# Altium project MPPT_600W.PrjPcb (part 2 of 2)

## Sheet MPPT_POWER.SchDoc
size A3; SheetNumber: 3; SheetTotal: 3
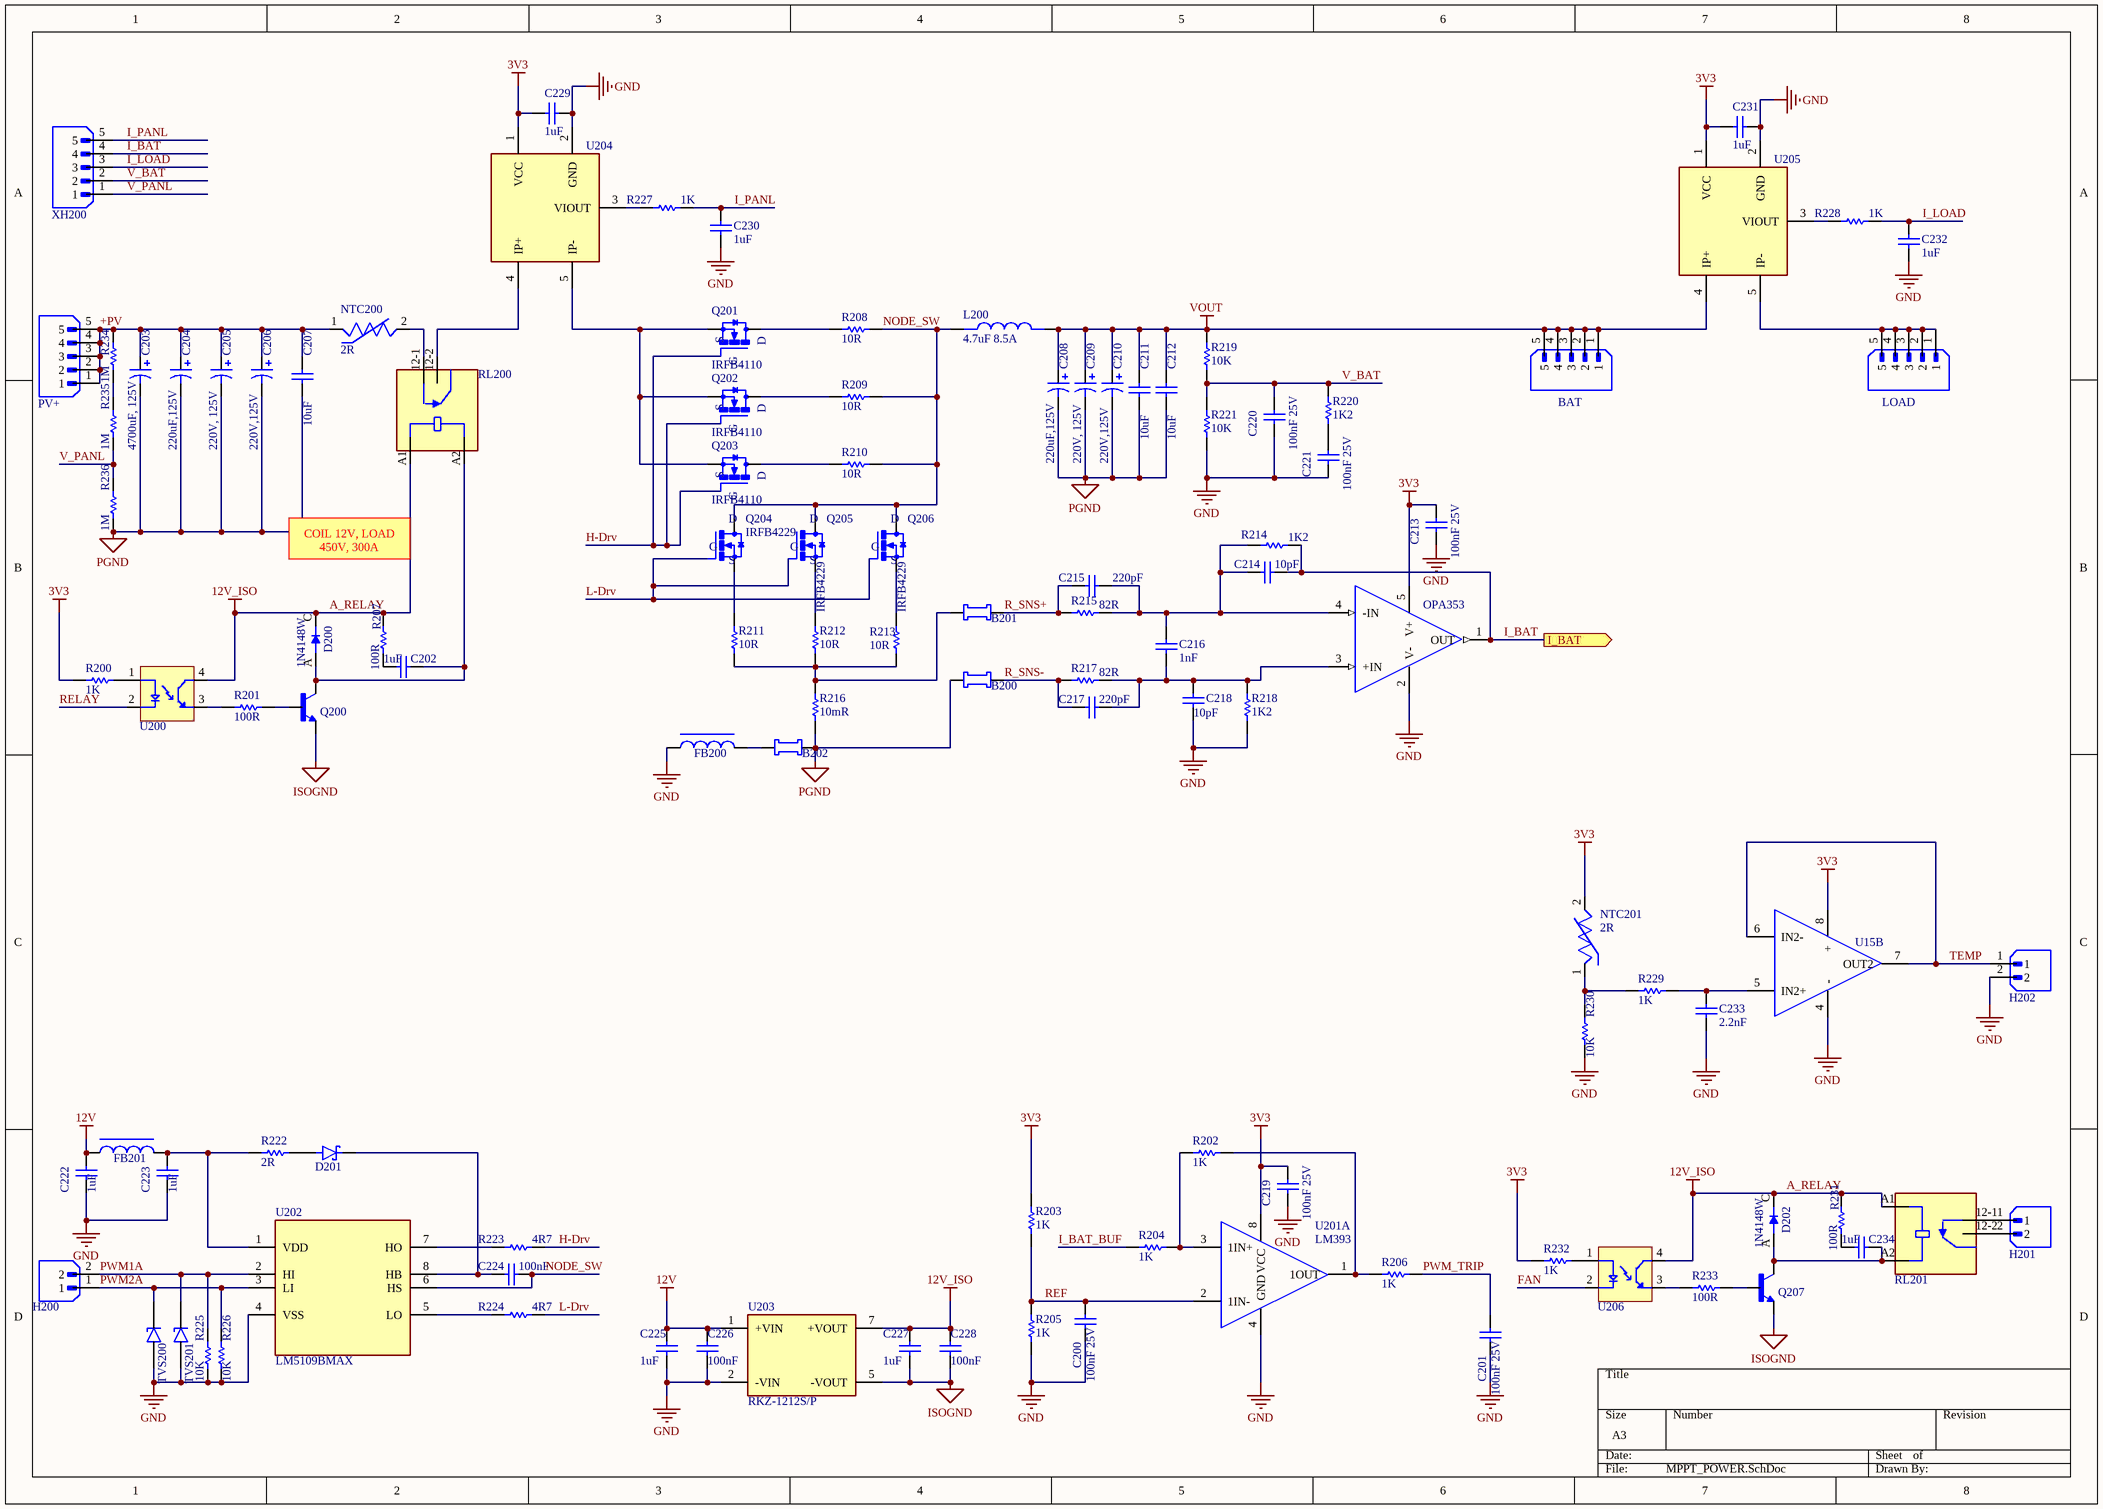
[diagram p1: MPPT_POWER.SchDoc]

### Parts
*  OPA353
B200  Narrow Neck Bridge  [Narrow Bridge]  (value not drawn)
B201  Narrow Neck Bridge  [Narrow Bridge]  (value not drawn)
B202  Narrow Neck Bridge  [Narrow Bridge]  (value not drawn)
BAT  B5B-XH-A(LF)(SN)  [XH2.54 5p]  (value not drawn)
C200  100nF 25V  [Cap cer 0603]
C201  100nF 25V  [Cap cer 0603]
C202  1uF  [Cap cer 0603]
C203  value 4700uF, 125V  [C0805]  (hidden comment: Cap Pol3)
C204  value 220uF,125V  [C0805]  (hidden comment: Cap Pol3)
C205  value 220V, 125V  [C0805]  (hidden comment: Cap Pol3)
C206  value 220V,125V  [C0805]  (hidden comment: Cap Pol3)
C207  10uF  [Cap cer 0603]
C208  value 220uF,125V  [C0805]  (hidden comment: Cap Pol3)
C209  value 220V, 125V  [C0805]  (hidden comment: Cap Pol3)
C210  value 220V,125V  [C0805]  (hidden comment: Cap Pol3)
C211  10uF  [Cap cer 0603]
C212  10uF  [Cap cer 0603]
C213  100nF 25V  [Cap cer 0603]
C214  10pF  [Cap cer 0603]
C215  220pF  [Cap cer 0603]
C216  1nF  [Cap cer 0603]
C217  220pF  [Cap cer 0603]
C218  10pF  [Cap cer 0603]
C219  100nF 25V  [Cap cer 0603]
C220  100nF 25V  [Cap cer 0603]
C221  100nF 25V  [Cap cer 0603]
C222  1uF  [Cap cer 0603]
C223  1uF  [Cap cer 0603]
C224  100nF  [Cap cer 0603]
C225  1uF  [Cap cer 0603]
C226  100nF  [Cap cer 0603]
C227  1uF  [Cap cer 0603]
C228  100nF  [Cap cer 0603]
C229  1uF  [Cap cer 0603]
C230  1uF  [Cap cer 0603]
C231  1uF  [Cap cer 0603]
C232  1uF  [Cap cer 0603]
C233  2.2nF  [Cap cer 0603]
C234  1uF  [Cap cer 0603]
D200  1N4148W  [1N4148]
D201  B340A-13-F  [B340A]  (value not drawn)
D202  1N4148W  [1N4148]
FB200  Ferrite Beads Multi-Layer 390Ohm 25% 100MHz 500mA 300mOhm DCR 0603 Automotive T/R  [FERRITE BEAD 0603]  (value not drawn)
FB201  Ferrite Beads Multi-Layer 390Ohm 25% 100MHz 500mA 300mOhm DCR 0603 Automotive T/R  [FERRITE BEAD 0603]  (value not drawn)
H200  HEADER 2P 2.54  [HEADER 2P 2.544]  (value not drawn)
H201  HEADER 2P 2.54  [HEADER 2P 2.544]  (value not drawn)
H202  HEADER 2P 2.54  [HEADER 2P 2.544]  (value not drawn)
L200  4.7uF 8.5A  [Inductor 4.7uF 8.5A]
LOAD  B5B-XH-A(LF)(SN)  [XH2.54 5p]  (value not drawn)
NTC200  2R
NTC201  2R
PV+  B5B-XH-A(LF)(SN)  [XH2.54 5p]  (value not drawn)
Q200  MMBT3904  [MMBT3904]  (value not drawn)
Q201  IRFB4110
Q202  IRFB4110
Q203  IRFB4110
Q204  IRFB4229
Q205  IRFB4229
Q206  IRFB4229
Q207  MMBT3904  [MMBT3904]  (value not drawn)
R200  1K  [Res 0603]
R201  100R  [Res 0603]
R202  1K  [Res 0603]
R203  1K  [Res 0603]
R204  1K  [Res 0603]
R205  1K  [Res 0603]
R206  1K  [Res 0603]
R207  100R  [Res 0603]
R208  10R  [Res 0603]
R209  10R  [Res 0603]
R210  10R  [Res 0603]
R211  10R  [Res 0603]
R212  10R  [Res 0603]
R213  10R  [Res 0603]
R214  1K2  [Res 0603]
R215  82R  [Res 0603]
R216  10mR  [Res 0603]
R217  82R  [Res 0603]
R218  1K2  [Res 0603]
R219  10K  [Res 0603]
R220  1K2  [Res 0603]
R221  10K  [Res 0603]
R222  2R  [Res 0603]
R223  4R7  [Res 0603]
R224  4R7  [Res 0603]
R225  10K  [Res 0603]
R226  10K  [Res 0603]
R227  1K  [Res 0603]
R228  1K  [Res 0603]
R229  1K  [Res 0603]
R230  10K  [Res 0603]
R231  100R  [Res 0603]
R232  1K  [Res 0603]
R233  100R  [Res 0603]
R234  1M  [Res 0603]
R235  1M  [Res 0603]
R236  1M  [Res 0603]
RL200  (no value)
RL201  (no value)
TVS200  SMCJ5.0A-13-F  [TVS 5V]  (value not drawn)
TVS201  SMCJ5.0A-13-F  [TVS 5V]  (value not drawn)
U15  LM358DT  [LM358]  (value not drawn)  (part B of 2)
U200  PC817X1NIP1B  [PC817]  (value not drawn)
U201  LM393  [lm393]  (part A of 2)
U202  LM5109BMAX  [LM5109B]
U203  RKZ-1212S/P  [1212S]
U204  ACS758LCB-100U-PFF-T  [ACS758]  (value not drawn)
U205  ACS758LCB-100U-PFF-T  [ACS758]  (value not drawn)
U206  PC817X1NIP1B  [PC817]  (value not drawn)
XH200  B5B-XH-A(LF)(SN)  [XH2.54 5p]  (value not drawn)

### Ports
I_BAT (out)

### Nets
3V3: *.5(V+) C213.2 C219.2 C229.2 C231.2 NTC201.2 R200.1 R203.2 R232.1 U15.8(+) U201.8(VCC) U204.1(VCC) U205.1(VCC)
12V: C222.2 C225.1 C226.1 FB201.1 U203.1(+VIN)
A_RELAY: C227.1 C228.1 D200.C(K) D202.C(K) R207.2 R231.2 RL200.A1(COIL1) RL201.A1(COIL1) U200.4(CT) U203.7(+VOUT) U206.4(CT)  [also labelled 12V_ISO]
GND: *.2(V-) C200.1 C201.1 C213.1 C218.2 C219.1 C220.1 C221.1 C222.1 C223.1 C225.2 C226.2 C229.1 C230.1 C231.1 C232.1 C233.2 FB200.1 H202.2 R205.1 R218.1 R221.1 R225.1 R226.1 R230.1 TVS200.2(A) TVS201.2(A) U15.4(-) U201.4(GND) U202.4(VSS) U203.2(-VIN) U204.2(GND) U205.2(GND)
ISOGND: C227.2 C228.2 Q200.2(E) Q207.2(E) U203.5(-VOUT)
PGND: B200.1 B202.2 C203.2 C204.2 C205.2 C206.2 C207.2 C208.2 C209.2 C210.2 C211.2 C212.2 R216.2 R236.1
VOUT: BAT.1 BAT.2 BAT.3 BAT.4 BAT.5 C208.1 C209.1 C210.1 C211.1 C212.1 L200.2 R219.2 U205.4(IP+)
+PV: C203.1 C204.1 C205.1 C206.1 C207.1 NTC200.1 PV+.1 PV+.2 PV+.3 PV+.4 PV+.5 R234.2
FAN: U206.2(C)
H-Drv: Q201.1(G) Q202.1(G) Q203.1(G) R223.1
I_BAT: *.1(OUT) C214.2 R214.1 XH200.4 ; port I_BAT
I_BAT_BUF: R204.1
I_LOAD: C232.2 R228.1 XH200.3
I_PANL: C230.2 R227.1 XH200.5
L-Drv: Q204.1(G) Q205.1(G) Q206.1(G) R224.1
NODE_SW: C224.1 L200.1 Q204.2(D) Q205.2(D) Q206.2(D) R208.2 R209.2 R210.2 U202.6(HS)
PWM1A: H200.2 R225.2 TVS201.1(C) U202.2(HI)
PWM2A: H200.1 R226.2 TVS200.1(C) U202.3(LI)
PWM_TRIP: C201.2 R206.2
R_SNS+: B201.2 C215.2 R215.1
R_SNS-: B200.2 C217.2 R217.1
REF: C200.2 R203.1 R205.2 U201.2(1IN-)
RELAY: U200.2(C)
TEMP: H202.1 U15.6(IN2-) U15.7(OUT2)
V_BAT: C220.2 R219.1 R220.1 R221.2 XH200.2
V_PANL: R235.1 R236.2 XH200.1
Net*_3: *.3(+IN) C216.2 C217.1 C218.1 R217.2 R218.2
Net*_4: *.4(-IN) C214.1 C215.1 C216.1 R214.2 R215.2
NetB201_1: B201.1 R211.1 R212.1 R213.1 R216.1
NetB202_1: B202.1 FB200.2
NetC202_1: C202.1 D200.A Q200.3(C) RL200.A2(COIL2)
NetC202_2: C202.2 R207.1
NetC221_2: C221.2 R220.2
NetC223_2: C223.2 FB201.2 R222.2 U202.1(VDD)
NetC224_2: C224.2 D201.C U202.8(HB)
NetC233_1: C233.1 R229.1 U15.5(IN2+)
NetC234_1: C234.1 D202.A Q207.3(C) RL201.A2(COIL2)
NetC234_2: C234.2 R231.1
NetD201_A: D201.A R222.1
NetH201_1: H201.1 RL201.12-1(NC)
NetH201_2: H201.2 RL201.12-2(NC)
NetLOAD_1: LOAD.1 LOAD.2 LOAD.3 LOAD.4 LOAD.5 U205.5(IP-)
NetNTC200_2: NTC200.2 RL200.12-1(NC)
NetNTC201_1: NTC201.1 R229.2 R230.2
NetQ200_1: Q200.1(B) R201.2
NetQ201_2: Q201.2(D) R208.1
NetQ201_3: Q201.3(S) Q202.3(S) Q203.3(S) U204.5(IP-)
NetQ202_2: Q202.2(D) R209.1
NetQ203_2: Q203.2(D) R210.1
NetQ204_3: Q204.3(S) R211.2
NetQ205_3: Q205.3(S) R212.2
NetQ206_3: Q206.3(S) R213.2
NetQ207_1: Q207.1(B) R233.2
NetR200_2: R200.2 U200.1(A)
NetR201_1: R201.1 U200.3(ET)
NetR202_1: R202.1 R204.2 U201.3(1IN+)
NetR202_2: R202.2 R206.1 U201.1(1OUT)
NetR223_2: R223.2 U202.7(HO)
NetR224_2: R224.2 U202.5(LO)
NetR227_2: R227.2 U204.3(VIOUT)
NetR228_2: R228.2 U205.3(VIOUT)
NetR232_2: R232.2 U206.1(A)
NetR233_1: R233.1 U206.3(ET)
NetR234_1: R234.1 R235.2
NetRL200_12-2: RL200.12-2(NC) U204.4(IP+)

### Notes on the sheet
- COIL 12V, LOAD 450V, 300A

### Library data of the parts
BAT LOAD PV+ XH200 = B5B-XH-A(LF)(SN): Connector Header, XH Series, 5 Position, 2.50mm, Through Hole, Press-Fit, Solder, Natural; Manufacturer: JST; Voltage Rating: 250V; Number of Positions: 5; Gender: 29Gender; Contact Post Length: 0.134inch; Mated Stacking Heights: 9.8mm; Supplier 1: Future Electronics; Manufacturer Part Number: B5B-XH-A(LF)(SN); RoHS: Yes; Category: Headers and Wire Housings; Stock 1: 3816; Pricing 1: 1=0,106, 250=0,103, 1000=0,0996, 2500=0,0972, 10000=0,0916 (USD); Mount: Through Hole; Contact Material: Brass; Contact Shape: Square; Contact Finish - Mating: TIN; Insulation Material: Nylon; Insulation Color: Natural; Weight: 28.349523g; Min Operating Temperature: -25°C; Max Operating Temperature: 85°C; Number of Rows: 1; Packaging: Bulk; Termination: Press-Fit; Fastening Type: Detent; Connector Type: Header; Series: XH; Contact Type: Male Pin; Insulation Height: 0.276inch; Lead Free: Lead Free; Flammability Rating: UL94 V-0; ComponentLink1URL: https://datasheet.ciiva.com/26894/getdatasheetpartid-455618-26894798.pdf?src-supplier=Verical; ComponentLink1Description: https://datasheet.ciiva.com/26894/getdatasheetpartid-455618-26894798.pdf?src-supplier=Verical; ComponentLink2URL: https://datasheet.ciiva.com/11746/0900766b8082f55f-11746654.pdf?src-supplier=Rs; ComponentLink2Description: https://datasheet.ciiva.com/11746/0900766b8082f55f-11746654.pdf?src-supplier=Rs; ComponentLink3URL: https://datasheet.ciiva.com/26894/getdatasheetpartid-640991-26894479.pdf?src-supplier=Verical; ComponentLink3Description: https://datasheet.ciiva.com/26894/getdatasheetpartid-640991-26894479.pdf?src-supplier=Verical; ComponentLink4URL: https://datasheet.ciiva.com/724/exh-724390.pdf?src-supplier=Digikey; ComponentLink4Description: https://datasheet.ciiva.com/724/exh-724390.pdf?src-supplier=Digikey; ComponentLink5URL: https://datasheet.ciiva.com/8052/1684882-8052063.pdf?src-supplier=Element14; ComponentLink5Description: https://datasheet.ciiva.com/8052/1684882-8052063.pdf?src-supplier=Element14; Supplier Part Number 1: 5006945
C200-C202 C207 C211-C234 = GCM188R71E104KA57D: Multilayer Ceramic Capacitor, 0.1 uF, 25 V, ï¿½ 10%, X7R, 0603 [1608 Metric]; Manufacturer: Murata; Supplier 1: Mouser; Manufacturer Part Number: GCM188R71E104KA57D; RoHS: Yes; Category: Ceramic Capacitors; Stock 1: 52188; Pricing 1: 1=0.26, 10=0.151, 50=0.151, 100=0.097, 1000=0.068, 10000=0.046 (USD); Lead Free: 5697LeadFree; ComponentLink1URL: https://datasheet.ciiva.com/18183/getdatasheetpartid-301637-18183609.pdf?src-supplier=Verical; ComponentLink1Description: https://datasheet.ciiva.com/18183/getdatasheetpartid-301637-18183609.pdf?src-supplier=Verical; ComponentLink2URL: https://datasheet.ciiva.com/3778/11371gcm188r71e104ka5723-3778030.pdf?src-supplier=Arrow+Electronics; ComponentLink2Description: https://datasheet.ciiva.com/3778/11371gcm188r71e104ka5723-3778030.pdf?src-supplier=Arrow+Electronics; ComponentLink3URL: https://datasheet.ciiva.com/6270/s0717e-6270619.pdf?src-supplier=Digikey; ComponentLink3Description: https://datasheet.ciiva.com/6270/s0717e-6270619.pdf?src-supplier=Digikey; ComponentLink4URL: https://datasheet.ciiva.com/6270/s0717e-6270620.pdf?src-supplier=Digikey; ComponentLink4Description: https://datasheet.ciiva.com/6270/s0717e-6270620.pdf?src-supplier=Digikey; ComponentLink5URL: https://datasheet.ciiva.com/6270/s0717e-6270621.pdf?src-supplier=Digikey; ComponentLink5Description: https://datasheet.ciiva.com/6270/s0717e-6270621.pdf?src-supplier=Digikey; Supplier Part Number 1: 81-GCM188R71E104KA7D
C203-C206 C208-C210 = Cap Pol3: Polarized Capacitor (Surface Mount); Published: 8-Jun-2000; LatestRevisionDate: 29-May-2009; LatestRevisionNote: IPC-7351 Footprint Added.; PackageReference: C0805; Publisher: Altium Limited; PackageDescription: Chip Capacitor
D200 D202 = 1N4148W-7-F: Small Signal Diode, Single, 100 V, 300 Ma, 1.25 V, 4 Ns, 2 A Rohs Compliant: Yes; Manufacturer: Diodes; Forward Current: 150mA; Reverse Recovery Time: 4ns; Max Repetitive Reverse Voltage (Vrrm): 100V; Max Forward Surge Current (Ifsm): 2A; Max Reverse Current: 1uA; Forward Voltage: 1.25V; Average Rectified Current: 300mA; Power Dissipation: 400mW; Polarity: Standard; Capacitance: 2pF; Voltage Rating (DC): 75V; Supplier 1: Arrow Electronics; Manufacturer Part Number: 1N4148W-7-F; RoHS: Yes; Category: Rectifier Diodes; Stock 1: 4485000; Pricing 1: 9000=0.0099, 15000=0.0099, 21000=0.0099, 30000=0.0099, 75000=0.0099 (USD); Mount: Surface Mount; Number of Pins: 2; Weight: 0.000353oz; Min Operating Temperature: -65°C; Max Operating Temperature: 150°C; Packaging: Tape and Reel; Peak Non-Repetitive Surge Current: 2A; Max Surge Current: 2A; Package Quantity: 3000; Recovery Time: 4ns; Power Rating: 400mW; Current Rating: 150mA; Output Current: 150mA; Voltage: 100V; Max Reverse Voltage (DC): 100V; Series: -; Reverse Recovery Time-Max: 4ns; Reverse Voltage: 100V; Length: 2.85mm; Width: 1.7mm; Height: 1.25mm; Radiation Hardening: No; Reach SVHC Compliant: No; Lead Free: Lead Free; RoHS Compliant: Yes; ComponentLink1URL: https://datasheet.ciiva.com/8303/ds30086-8303197.pdf?src-supplier=Avnet; ComponentLink1Description: https://datasheet.ciiva.com/8303/ds30086-8303197.pdf?src-supplier=Avnet; ComponentLink2URL: https://datasheet.ciiva.com/911/ds30086-911735.pdf?src-supplier=Digikey; ComponentLink2Description: https://datasheet.ciiva.com/911/ds30086-911735.pdf?src-supplier=Digikey; ComponentLink3URL: https://datasheet.ciiva.com/911/ds30086-911736.pdf?src-supplier=Digikey; ComponentLink3Description: https://datasheet.ciiva.com/911/ds30086-911736.pdf?src-supplier=Digikey; ComponentLink4URL: https://datasheet.ciiva.com/911/ds30086-911734.pdf?src-supplier=Digikey; ComponentLink4Description: https://datasheet.ciiva.com/911/ds30086-911734.pdf?src-supplier=Digikey; ComponentLink5URL: https://datasheet.ciiva.com/1179/1915529-1179304.pdf?src-supplier=Element14; ComponentLink5Description: https://datasheet.ciiva.com/1179/1915529-1179304.pdf?src-supplier=Element14; ComponentLink6URL: https://datasheet.ciiva.com/22695/1915529-22695239.pdf?src-supplier=Element14; ComponentLink6Description: https://datasheet.ciiva.com/22695/1915529-22695239.pdf?src-supplier=Element14; ComponentLink7URL: https://datasheet.ciiva.com/8300/ds30086-8300392.pdf?src-supplier=Avnet; ComponentLink7Description: https://datasheet.ciiva.com/8300/ds30086-8300392.pdf?src-supplier=Avnet; ComponentLink8URL: https://datasheet.ciiva.com/15219/getdatasheetpartid-110030-15219548.pdf?src-supplier=Verical; ComponentLink8Description: https://datasheet.ciiva.com/15219/getdatasheetpartid-110030-15219548.pdf?src-supplier=Verical; ComponentLink9URL: https://datasheet.ciiva.com/4435/ds30086-4435128.pdf?src-supplier=Mouser; ComponentLink9Description: https://datasheet.ciiva.com/4435/ds30086-4435128.pdf?src-supplier=Mouser; Supplier Part Number 1: 1N4148W-7-F
D201 = B340A-13-F: Schottky Diode, 3A, 40V, DO-214AC; Manufacturer: Diodes; Forward Voltage: 500mV; Peak Non-Repetitive Surge Current: 80A; Max Reverse Current: 500uA; Polarity: Standard; Capacitance: 250pF; Supplier 1: Digikey; Manufacturer Part Number: B340A-13-F; RoHS: Yes; Category: LDO; Stock 1: 167709; Pricing 1: 1=0,41, 10=0,257, 100=0,2251, 500=0,16972, 1000=0,14704, 2000=0,13679, 5000=0,09696, 10000=0,09188 (USD); Mount: Surface Mount; Case/Package: SMA; Number of Pins: 2; Weight: 0.002258oz; Min Operating Temperature: -55°C; Max Operating Temperature: 125°C; Forward Current: 3A; Packaging: Tape and Reel; Package Quantity: 5000; Average Rectified Current: 3A; Max Repetitive Reverse Voltage (Vrrm): 40V; Max Forward Surge Current (Ifsm): 80A; Termination: SMD/SMT; Voltage Rating (DC): 40V; Current Rating: 3A; Output Current: 3A; Current: 3A; Voltage: 40V; Max Reverse Voltage (DC): 40V; Series: -; Length: 4.6mm; Width: 2.92mm; Height: 2.3mm; Radiation Hardening: No; RoHS Compliant: Yes; Reach SVHC Compliant: No; Lead Free: Lead Free; Supplier Part Number 1: B340A-FDICT-ND
FB200 FB201 = Ferrite Bead: Manufacturer: Murata; Manufacturer Part Number: BLM18EG391TH1D; Impedance: 390R; Number of Circuits: 1; Supplier 1: Digikey; RoHS: Yes; Category: Ferrite Beads and Chips; Pricing 1: 4000=0,0747 (USD); Mount: Surface Mount; Case/Package: 0603; Case Code (Imperial): 0603; Min Operating Temperature: -55°C; Max Operating Temperature: 125°C; Packaging: Tape and Reel; Tolerance: 25%; Package Quantity: 4000; Termination: SMD/SMT; Test Frequency: 100MHz; Max DC Current: 500mA; Series: EMIFIL®, BLM18; Number of Lines: 1; Length: 1.6mm; Width: 0.8mm; Height: 0.8mm; Depth: 0.95mm; RoHS Compliant: Yes; ComponentLink1URL: https://datasheet.ciiva.com/8510/l0132s0193blm18e-shth-8510168.pdf?src-supplier=Avnet; ComponentLink1Description: https://datasheet.ciiva.com/8510/l0132s0193blm18e-shth-8510168.pdf?src-supplier=Avnet; Supplier Part Number 1: BLM18EG391TH1D-ND
H200-H202 = B2B-XH-A(LF)(SN): CONNECTOR HEADER, XH SERIES, 2 POSITION, 2.50MM, Press-Fit Solder, Detent Lock, Natural; Manufacturer: JST; Current Rating: 3A; Number of Positions: 2; Contact Resistance: 20mR; Insulation Resistance: 1GR; Voltage Rating: 250V; Pitch: 2.5mm; Wire/Cable Gauge: 22AWG; Supplier 1: Future Electronics; Manufacturer Part Number: B2B-XH-A(LF)(SN); RoHS: Yes; Category: Headers and Wire Housings; Stock 1: 138390; Pricing 1: 1=0,0544, 500=0,0528, 1500=0,0514, 5000=0,0499, 15000=0,0472 (USD); Mount: Through Hole; Contact Material: Brass; Contact Plating: Tin,Lead,Copper; Housing Material: Polyamide; Color: Natural; Housing Color: White; Weight: 28.349523g; Min Operating Temperature: -25°C; Max Operating Temperature: 85°C; Termination: Solder; Number of Rows: 1; Packaging: Bulk; Series: XH; Orientation: Straight; Contact Type: Male Pin; Max Current Rating: 3A; Fastening Type: Detent; Max Voltage Rating (AC): 250V; Number of Contacts: 2; Voltage Rating (AC): 250V; Max Voltage Rating (DC): 250V; Length: 7.4mm; Depth: 5.75mm; Lead Pitch: 2.5mm; Lead Free: Lead Free; Reach SVHC Compliant: No; ComponentLink1URL: https://datasheet.ciiva.com/11746/0900766b8082653e-11746979.pdf?src-supplier=Rs; ComponentLink1Description: https://datasheet.ciiva.com/11746/0900766b8082653e-11746979.pdf?src-supplier=Rs; ComponentLink2URL: https://datasheet.ciiva.com/26894/getdatasheetpartid-385291-26894760.pdf?src-supplier=Verical; ComponentLink2Description: https://datasheet.ciiva.com/26894/getdatasheetpartid-385291-26894760.pdf?src-supplier=Verical; ComponentLink3URL: https://datasheet.ciiva.com/26894/getdatasheetpartid-640357-26894434.pdf?src-supplier=Verical; ComponentLink3Description: https://datasheet.ciiva.com/26894/getdatasheetpartid-640357-26894434.pdf?src-supplier=Verical; ComponentLink4URL: https://datasheet.ciiva.com/8052/5448-8052024.pdf?src-supplier=Element14; ComponentLink4Description: https://datasheet.ciiva.com/8052/5448-8052024.pdf?src-supplier=Element14; Supplier Part Number 1: 1638840
L200 = Inductor 4.7uF 8.5A: FIXED IND 4.7UH 8.5A 18.4MOHM; Manufacturer: Abracon; Manufacturer Part Number: ASPIAIG-F6050-4R7M-T; Supplier 1: Mouser; RoHS: No; Category: Fixed Inductors; Stock 1: 897; Pricing 1: 1=1.3, 10=1.07, 50=1.07, 100=0.828, 1000=0.668, 10000=0.625 (USD); ComponentLink1URL: https://datasheet.octopart.com/ASPIAIG-F6050-4R7M-T-Abracon-datasheet-113089578.pdf?src-supplier=Future+Electronics; ComponentLink1Description: https://datasheet.octopart.com/ASPIAIG-F6050-4R7M-T-Abracon-datasheet-113089578.pdf?src-supplier=Future+Electronics; ComponentLink2URL: https://abracon.com/Magnetics/power/ASPIAIG-F.pdf?src-supplier=Digikey; ComponentLink2Description: https://abracon.com/Magnetics/power/ASPIAIG-F.pdf?src-supplier=Digikey; Supplier Part Number 1: 815-SPIAIGF60504.7MT
NTC200 NTC201 = NTC
Q200 Q207 = MMBT3904: MMBT3904 Series 40 V CE Breakdown 0.2 A NPN General Purpose Amplifier - SOT-23; Manufacturer: onsemi; Collector Emitter Voltage (VCEO): 40V; Current Rating: 200mA; hFE Min: 100; Max Power Dissipation: 350mW; Transition Frequency: 300MHz; Collector Base Voltage (VCBO): 60V; Emitter Base Voltage (VEBO): 6V; Collector Emitter Saturation Voltage: 300mV; Supplier 1: Farnell; Manufacturer Part Number: MMBT3904; RoHS: Yes; Category: BJTs; Pricing 1: 5=0,136, 25=0,133, 100=0,0476, 250=0,0435, 500=0,043, 1000=0,022, 5000=0,02 (GBP); Mount: Surface Mount; Case/Package: SOT-23; Number of Pins: 3; Weight: 0.03g; Min Operating Temperature: -55°C; Max Operating Temperature: 150°C; Packaging: Tape and Reel; Polarity: NPN; Collector Emitter Breakdown Voltage: 40V; Voltage Rating (DC): 40V; Package Quantity: 1; Max Collector Current: 200mA; Max Breakdown Voltage: 40V; Series: -; Collector-emitter Voltage-Max: 300mV; Termination: SMD/SMT; Radiation Hardening: No; RoHS Compliant: Yes; Reach SVHC Compliant: No; Lead Free: Lead Free; ComponentLink1URL: http://www.farnell.com/datasheets/2304127.pdf?src-supplier=Farnell; ComponentLink1Description: http://www.farnell.com/datasheets/2304127.pdf?src-supplier=Farnell; ComponentLink2URL: http://www.onlinecomponents.com/datasheet/mmbt3904.aspx?p=11366981&src-supplier=Onlinecomponents.com; ComponentLink2Description: http://www.onlinecomponents.com/datasheet/mmbt3904.aspx?p=11366981&src-supplier=Onlinecomponents.com; ComponentLink3URL: http://components.arrow.com/part/dataview/201938S7901518N7769?src-supplier=Arrow+Electronics; ComponentLink3Description: http://components.arrow.com/part/dataview/201938S7901518N7769?src-supplier=Arrow+Electronics; ComponentLink4URL: http://www.produktinfo.conrad.com/datenblaetter/1200000-1299999/001264825-da-01-en-TRANSISTOR_GP_NPN_MMBT3904_SOT_23_3_FSC.pdf?src-supplier=Conrad; ComponentLink4Description: http://www.produktinfo.conrad.com/datenblaetter/1200000-1299999/001264825-da-01-en-TRANSISTOR_GP_NPN_MMBT3904_SOT_23_3_FSC.pdf?src-supplier=Conrad; Supplier Part Number 1: 9846727
Q201-Q206 = MOSFET
R200-R236 = Resistor 2.2K: Res Thick Film 0603 2.2K Ohm 5% 1/10W ±200ppm/°C Molded SMD SMD Paper T/R; Manufacturer: Vishay; Manufacturer Part Number: CRCW06032K20JNEA; Resistance: 2.2kR; Power Rating: 100mW; Voltage Rating: 75V; Supplier 1: Arrow Electronics; RoHS: Yes; Category: Chip SMD Resistors; Stock 1: 130000; Pricing 1: 5000=0.0053 (USD); Case/Package: 0603; Weight: 7.1E-05oz; Case Code (Metric): 1608; Case Code (Imperial): 0603; Contact Plating: Tin; Size Code: 0603; Min Operating Temperature: -55°C; Max Operating Temperature: 155°C; Package Quantity: 5000; Tolerance: 5%; Packaging: Tape and Reel; Resistor Type: Thick Film; Number of Terminations: 2; Temperature Coefficient: 200ppm/°C; Termination: SMD/SMT; Max Power Dissipation: 100mW; Features: Automotive AEC-Q200; Series: CRCW; Resistance Tolerance: 5%; Construction: Rectangular; Length: 1.55mm; Width: 0.85mm; Height: 0.45mm; Depth: 0.85mm; Ratings: AEC-Q200; Radiation Hardening: No; Military Standard: Not; RoHS Compliant: Yes; Reach SVHC Compliant: Unknown; Lead Free: 5697LeadFree; ComponentLink1URL: https://datasheet.ciiva.com/2462/dcrcwe3-2462048.pdf?src-supplier=Digikey; ComponentLink1Description: https://datasheet.ciiva.com/2462/dcrcwe3-2462048.pdf?src-supplier=Digikey; ComponentLink2URL: https://datasheet.ciiva.com/16767/70201119-16767464.pdf?src-supplier=Allied+Electronics; ComponentLink2Description: https://datasheet.ciiva.com/16767/70201119-16767464.pdf?src-supplier=Allied+Electronics; ComponentLink3URL: https://datasheet.ciiva.com/2462/dcrcwe3-2462046.pdf?src-supplier=Digikey; ComponentLink3Description: https://datasheet.ciiva.com/2462/dcrcwe3-2462046.pdf?src-supplier=Digikey; ComponentLink4URL: https://datasheet.ciiva.com/5541/dcrcwe3-109170-5541959.pdf?src-supplier=Mouser; ComponentLink4Description: https://datasheet.ciiva.com/5541/dcrcwe3-109170-5541959.pdf?src-supplier=Mouser; ComponentLink5URL: https://datasheet.ciiva.com/16286/dcrcwe3-16286997.pdf?src-supplier=Future+Electronics; ComponentLink5Description: https://datasheet.ciiva.com/16286/dcrcwe3-16286997.pdf?src-supplier=Future+Electronics; Supplier Part Number 1: CRCW06032K20JNEA
RL200 RL201 = HFE-Relay: COIL 12, LOAD 450V, 300A
TVS200 TVS201 = SMCJ5.0A-13-F: SMCJ5.0A Series 1500 W 5.0 V Surface Mount Uni-Directional TVS Diode - DO-214AB; Manufacturer: Diodes; Voltage Rating (DC): 51V; Forward Voltage: 3.5V; Direction: Unidirectional; Reverse Breakdown Voltage: 6.4V; Max Surge Current: 200A; Number of Unidirectional Channels: 1; Reverse Standoff Voltage: 5V; Clamping Voltage: 9.2V; Peak Pulse Power: 1.5kW; Power Line Protection: No; Peak Pulse Current: 163A; Test Current: 10mA; Max Breakdown Voltage: 7.07V; Max Reverse Leakage Current: 1mA; Capacitance: 7nF; Diode Type: ZENER; Supplier 1: Digikey; Manufacturer Part Number: SMCJ5.0A-13-F; RoHS: Yes; Category: TVS Diodes; Stock 1: 6833; Pricing 1: 1=0,72, 10=0,569, 100=0,32, 500=0,306, 1000=0,29 (USD); Mount: Surface Mount; Case/Package: SMC; Number of Pins: 2; Min Operating Temperature: -55°C; Max Operating Temperature: 150°C; Package Quantity: 3000; Packaging: Tape and Reel; Min Breakdown Voltage: 6.4V; Polarity: Unidirectional; Termination: SMD/SMT; Working Voltage: 5V; Breakdown Voltage: 6.4V; Max Power Dissipation: 1.5kW; Number of Elements: 1; Power Dissipation: 1.5kW; Leakage Current: 1mA; Max Output Current: 163A; Series: -; Clamping Voltage-Max: 9.2V; Length: 7.11mm; Width: 6.22mm; Height: 2.62mm; Radiation Hardening: No; Lead Free: Lead Free; RoHS Compliant: Yes; ComponentLink1URL: https://datasheet.ciiva.com/336/ds19003-336384.pdf?src-supplier=Digikey; ComponentLink1Description: https://datasheet.ciiva.com/336/ds19003-336384.pdf?src-supplier=Digikey; ComponentLink2URL: https://datasheet.ciiva.com/15143/getdatasheetpartid-171808-15143868.pdf?src-supplier=Verical; ComponentLink2Description: https://datasheet.ciiva.com/15143/getdatasheetpartid-171808-15143868.pdf?src-supplier=Verical; Supplier Part Number 1: SMCJ5.0A-FDICT-ND
U15 = LM358DT: Operational Amplifier, 2-Channels, 1.1 MHz, 0.6 V/us, 3 V to 30 V, 8 Pins, SOIC; Manufacturer: STMicroelectronics; Supplier 1: Arrow Electronics; Manufacturer Part Number: LM358DT; RoHS: Yes; Category: Amplifiers - Op Amps, Buffer, Instrumentation; Stock 1: 6035000; Pricing 1: 2500=0,0596, 10000=0,056, 20000=0,0553 (USD); Lead Free: 5697LeadFree; ComponentLink1URL: https://datasheet.ciiva.com/15129/getdatasheetpartid-39583-15129679.pdf?src-supplier=Verical; ComponentLink1Description: https://datasheet.ciiva.com/15129/getdatasheetpartid-39583-15129679.pdf?src-supplier=Verical; ComponentLink2URL: https://datasheet.ciiva.com/29306/155599-da-01-en-op-verst-lm358dt-stm-29306826.pdf?src-supplier=Conrad; ComponentLink2Description: https://datasheet.ciiva.com/29306/155599-da-01-en-op-verst-lm358dt-stm-29306826.pdf?src-supplier=Conrad; ComponentLink3URL: https://datasheet.ciiva.com/14544/70013561-14544747.pdf?src-supplier=Allied+Electronics; ComponentLink3Description: https://datasheet.ciiva.com/14544/70013561-14544747.pdf?src-supplier=Allied+Electronics; ComponentLink4URL: https://datasheet.ciiva.com/16371/cd00000464-16371207.pdf?src-supplier=Future+Electronics; ComponentLink4Description: https://datasheet.ciiva.com/16371/cd00000464-16371207.pdf?src-supplier=Future+Electronics; ComponentLink5URL: https://datasheet.ciiva.com/1795/cd00000464-1795490.pdf?src-supplier=Digikey; ComponentLink5Description: https://datasheet.ciiva.com/1795/cd00000464-1795490.pdf?src-supplier=Digikey; ComponentLink6URL: https://datasheet.ciiva.com/1795/cd00000464-1795491.pdf?src-supplier=Digikey; ComponentLink6Description: https://datasheet.ciiva.com/1795/cd00000464-1795491.pdf?src-supplier=Digikey; ComponentLink7URL: https://datasheet.ciiva.com/1795/cd00000464-1795492.pdf?src-supplier=Digikey; ComponentLink7Description: https://datasheet.ciiva.com/1795/cd00000464-1795492.pdf?src-supplier=Digikey; Supplier Part Number 1: LM358DT
U200 U206 = PC817X1NIP1B: Optocoupler Dc-in 1-CH Transistor Dc-out 4-PIN DIP SMD T/r; Manufacturer: Sharp; Number of Channels: 1NUMBER; Supplier 1: Mouser; Manufacturer Part Number: PC817X1NIP1B; RoHS: Yes; Category: Optocouplers; Pricing 1: 1=0,7, 10=0,473, 50=0,473, 100=0,343, 1000=0,277, 10000=0,181 (USD); ComponentLink1URL: https://datasheet.octopart.com/PC817X1NIP1B-Sharp-datasheet-81842616.pdf?src-supplier=TME; ComponentLink1Description: https://datasheet.octopart.com/PC817X1NIP1B-Sharp-datasheet-81842616.pdf?src-supplier=TME; Supplier Part Number 1: 852-PC817X1NIP1B
U201 = LM393DT: LM393 Series Dual 36 V 250 nA SMT Low Power Voltage Comparator - SOIC-8; Manufacturer: STMicroelectronics; Supplier 1: Arrow Electronics; Manufacturer Part Number: LM393DT; RoHS: Yes; Category: Comparators; Stock 1: 3735000; Pricing 1: 2500=0,0603, 7500=0,0589, 12500=0,0587, 17500=0,0577, 25000=0,0566, 62500=0,0562, 125000=0,0549 (USD); ComponentLink1URL: https://datasheet.ciiva.com/14153/lm393-st-tds-eng-14153514.pdf?src-supplier=Distrelec; ComponentLink1Description: https://datasheet.ciiva.com/14153/lm393-st-tds-eng-14153514.pdf?src-supplier=Distrelec; ComponentLink2URL: https://datasheet.ciiva.com/1827/cd00000465-1827142.pdf?src-supplier=Digikey; ComponentLink2Description: https://datasheet.ciiva.com/1827/cd00000465-1827142.pdf?src-supplier=Digikey; ComponentLink3URL: https://datasheet.ciiva.com/1827/cd00000465-1827143.pdf?src-supplier=Digikey; ComponentLink3Description: https://datasheet.ciiva.com/1827/cd00000465-1827143.pdf?src-supplier=Digikey; ComponentLink4URL: https://datasheet.ciiva.com/1827/cd00000465-1827144.pdf?src-supplier=Digikey; ComponentLink4Description: https://datasheet.ciiva.com/1827/cd00000465-1827144.pdf?src-supplier=Digikey; ComponentLink5URL: https://datasheet.ciiva.com/2970/cd00000465-2970521.pdf?src-supplier=Avnet; ComponentLink5Description: https://datasheet.ciiva.com/2970/cd00000465-2970521.pdf?src-supplier=Avnet; ComponentLink6URL: https://datasheet.ciiva.com/4463/cd00000465-4463849.pdf?src-supplier=Mouser; ComponentLink6Description: https://datasheet.ciiva.com/4463/cd00000465-4463849.pdf?src-supplier=Mouser; ComponentLink7URL: https://datasheet.ciiva.com/8067/1689826-8067369.pdf?src-supplier=Element14; ComponentLink7Description: https://datasheet.ciiva.com/8067/1689826-8067369.pdf?src-supplier=Element14; ComponentLink8URL: https://datasheet.ciiva.com/1483/1689826-1483069.pdf?src-supplier=Element14; ComponentLink8Description: https://datasheet.ciiva.com/1483/1689826-1483069.pdf?src-supplier=Element14; Supplier Part Number 1: LM393DT
U202 = LM5109BMAX/NOPB: 1-A, 100-V half bridge gate driver with 8-V UVLO and high noise immunity 8-SOIC -40 to 125; Manufacturer: TI National Semiconductor; Supplier 1: Mouser; Manufacturer Part Number: LM5109BMAX/NOPB; RoHS: Yes; Category: Gate Drivers; Stock 1: 6394; Pricing 1: 1=0,85, 10=0,609, 50=0,548, 100=0,482, 1000=0,415, 10000=0,374 (USD); ComponentLink1URL: https://datasheet.ciiva.com/6609/lm5109b-6609744.pdf?src-supplier=Digikey; ComponentLink1Description: https://datasheet.ciiva.com/6609/lm5109b-6609744.pdf?src-supplier=Digikey; ComponentLink2URL: https://datasheet.ciiva.com/41458/001014174-da-01-en-ic-dvr-half-b-lm5109bmax-nopb-soic-8-tid-41458460.pdf?src-supplier=Conrad; ComponentLink2Description: https://datasheet.ciiva.com/41458/001014174-da-01-en-ic-dvr-half-b-lm5109bmax-nopb-soic-8-tid-41458460.pdf?src-supplier=Conrad; ComponentLink3URL: https://datasheet.ciiva.com/6609/lm5109b-6609743.pdf?src-supplier=Digikey; ComponentLink3Description: https://datasheet.ciiva.com/6609/lm5109b-6609743.pdf?src-supplier=Digikey; Supplier Part Number 1: 926-LM5109BMAX/NOPB
U203 = RKZ-1212S/P: 2W DC/DC-Converter 'ECONOLINE' SIP7 3kV unreg; V. In: 12; V. Out: 12; mA. Out: 168; Manufacturer: Recom; Supplier 1: Digikey; Manufacturer Part Number: RKZ-1212S/P; RoHS: Yes; Category: Board Mount Modules; Stock 1: 900; Pricing 1: 1=10,37, 5=10,05, 10=9,59, 25=9,29, 50=9,17, 100=8,9, 250=8,31004 (USD); ComponentLink1URL: https://datasheet.ciiva.com/2175/rkz-2175652.pdf?src-supplier=Digikey; ComponentLink1Description: https://datasheet.ciiva.com/2175/rkz-2175652.pdf?src-supplier=Digikey; Supplier Part Number 1: 945-2710-5-ND
U204 U205 = ACS758LCB-100U-PFF-T: Open Loop Current Sensor AC/DC Current 5V Automotive 5-Pin Case CB-PFF Tube; Manufacturer: Allegro MicroSystems; Output Current: 1mA; Max Supply Current: 13.5mA; Min Supply Voltage: 3V; Max Supply Voltage: 5.5V; Bandwidth: 120kHz; Number of Channels: 1; Response Time: 4us; Quiescent Current: 10mA; Linearity: 1.25%; Accuracy: 2.4%; Current Sensing: 100A; Sensitivity: 40mV/A; Sensing Method: 6244SensingMethod; Supplier 1: Digikey; Manufacturer Part Number: ACS758LCB-100U-PFF-T; RoHS: Yes; Category: Current Sensors; Stock 1: 728; Pricing 1: 1=7,94, 5=7,17, 10=6,884, 34=6,43618, 68=6,21118, 102=6,08833, 510=5,65765, 1020=5,49716 (USD); Mount: Through Hole; Number of Pins: 5; Min Operating Temperature: -40°C; Max Operating Temperature: 150°C; Operating Supply Voltage: 5V; Packaging: Rail/Tube; Frequency: 120kHz; Series: Automotive, AEC-Q100; Operating Supply Current: 10mA; Length: 10mm; Width: 13mm; Height: 7mm; Radiation Hardening: No; Reach SVHC Compliant: No; RoHS Compliant: Yes; ComponentLink1URL: https://datasheet.ciiva.com/1165/acs758-datasheet-1165150.pdf?src-supplier=Element14; ComponentLink1Description: https://datasheet.ciiva.com/1165/acs758-datasheet-1165150.pdf?src-supplier=Element14; Supplier Part Number 1: 620-1354-ND

## Nets that join several sheets
3V3: MPPT_MCU (24 pins), MPPT_POWER (13 pins)
GND: MPPT_MCU (62 pins), MPPT_POWER (33 pins)